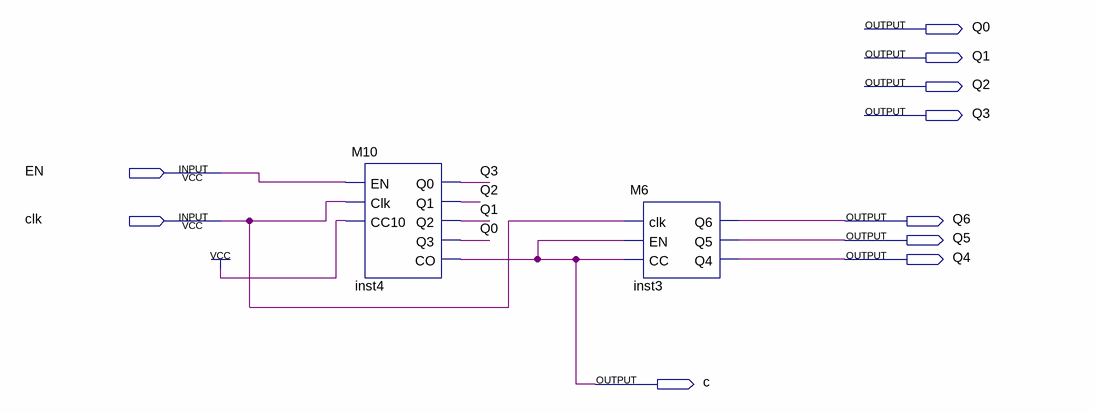
[diagram p0: schematic sheet]
// Quartus schematic M60.bdf as structural Verilog: 2 symbols, 10 pins
module M60 (
  input  EN,
  input  clk,
  output Q0,
  output Q1,
  output Q2,
  output Q3,
  output Q6,
  output Q5,
  output Q4,
  output c
);

  M10 inst4 (.EN(EN), .Clk(clk), .CC10(1'b1), .Q0(Q3), .Q1(Q2), .Q2(Q1), .Q3(Q0), .CO(c));
  M6 inst3 (.clk(clk), .EN(c), .CC(c), .Q6(Q6), .Q5(Q5), .Q4(Q4));
endmodule
